# EAGLE schematic PSAS_Safety_System (EAGLE 6.2)
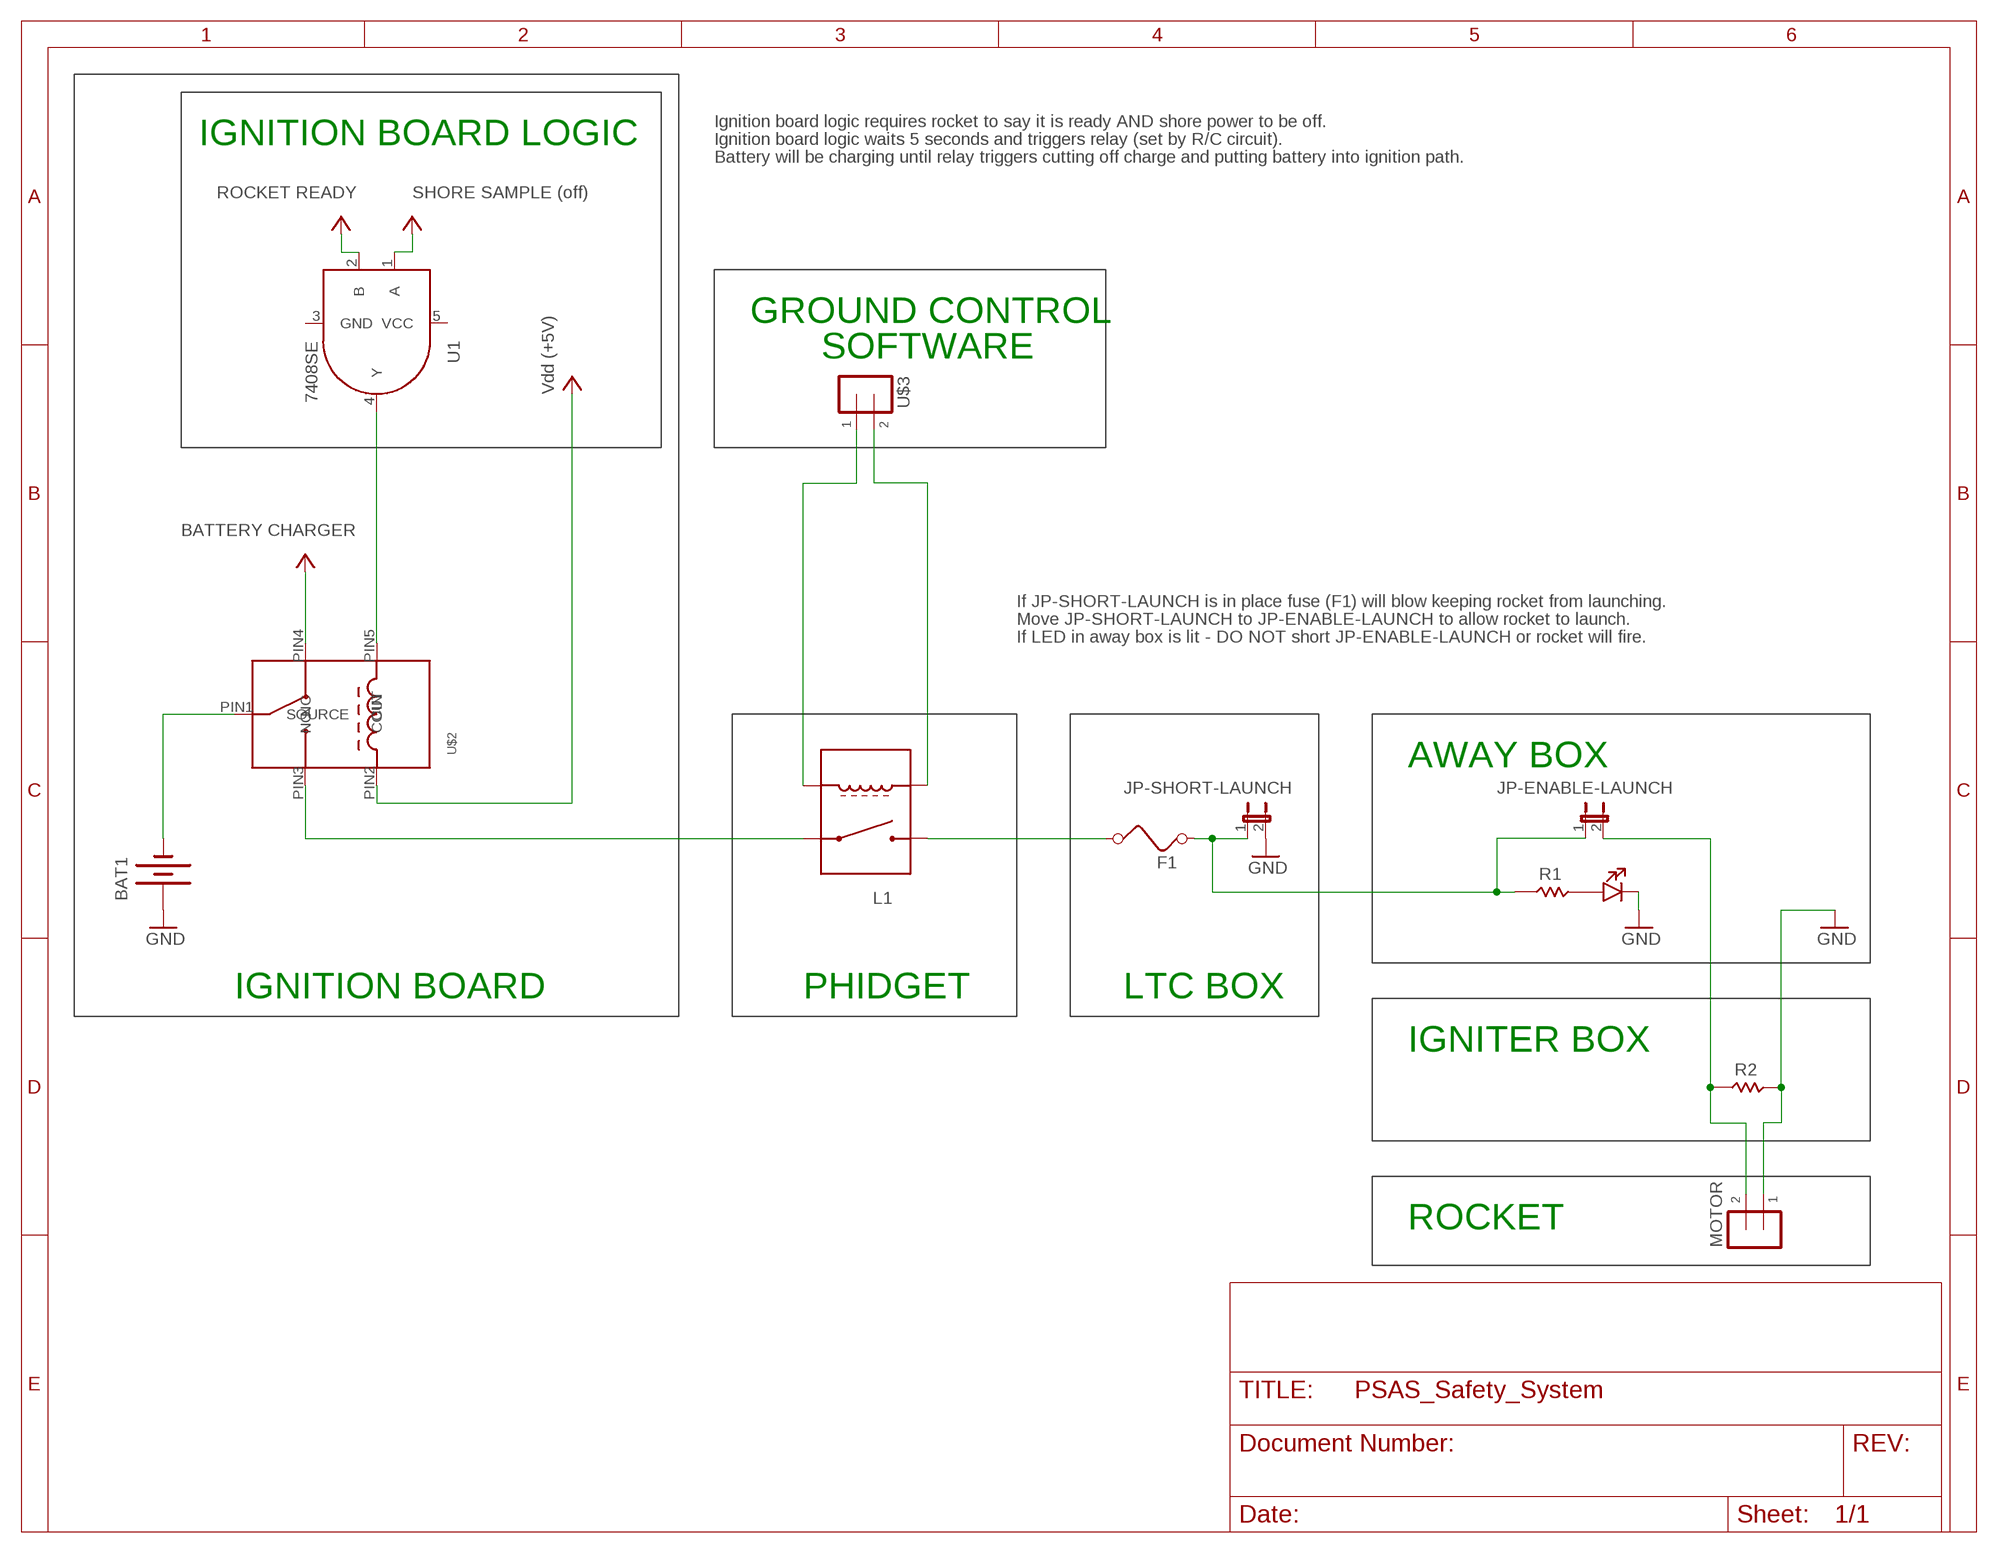
[diagram p0: schematic, sheet 1]

## Parts
BAT1  BATTERY12MM  [BATTCON_12MM]
F1  FUSE  [FUSE]
JP-ENABLE-LAUNCH  JP1E  [JP1]
JP-SHORT-LAUNCH  JP1E  [JP1]
L1  RELAY  [G5T-1A]
MOTOR  SCREW-TERMINAL-5MM  [SCREW-TERM-5MM]
R1  RESISTOR-0805  [0805]
R2  RESISTOR-0805  [0805]
U1  7408SE  [SOT353]
U$1  LED-550-XX04  [LED-550]
U$2  RELAY-2  [G5LA]
U$3  SCREW-TERMINAL-5MM  [SCREW-TERM-5MM]

## Nets
GND: BAT1.PWR@1(+) JP-SHORT-LAUNCH.2 MOTOR.1 R2.CATHODE U$1.CATHODE
N$1: R1.CATHODE U$1.ANODE
N$3: JP-ENABLE-LAUNCH.2 MOTOR.2 R2.ANODE
N$4: U1.4(Y) U$2.PIN5(CIN)
N$5: BAT1.GND(-) U$2.PIN1(SOURCE)
N$6: L1.SW1 U$2.PIN3(NO)
N$7: L1.CIN U$3.1
N$8: L1.COUT U$3.2
N$9: F1.2 L1.SW2
N$10: F1.1 JP-ENABLE-LAUNCH.1 JP-SHORT-LAUNCH.1 R1.ANODE
VCC: U1.1(A) U1.2(B) U$2.PIN2(COUT) U$2.PIN4(NC) ; supply symbol labelled BATTERY CHARGER, ROCKET READY, SHORE SAMPLE (off), Vdd (+5V)
Unconnected: U1.3(GND) U1.5(VCC)

## Notes on the sheet
- Ignition board logic requires rocket to say it is ready AND shore power to be off.
- IGNITION BOARD LOGIC | Ignition board logic waits 5 seconds and triggers relay (set by R/C circuit).
- Battery will be charging until relay triggers cutting off charge and putting battery into ignition path.
- GROUND CONTROL
- SOFTWARE
- If JP-SHORT-LAUNCH is in place fuse (F1) will blow keeping rocket from launching.
- Move JP-SHORT-LAUNCH to JP-ENABLE-LAUNCH to allow rocket to launch.
- If LED in away box is lit - DO NOT short JP-ENABLE-LAUNCH or rocket will fire.
- AWAY BOX
- IGNITION BOARD | PHIDGET | LTC BOX
- IGNITER BOX
- ROCKET

## Library data of the parts
BAT1 = SparkFun:BATTERY: Battery Holders Various common sizes : AA, AAA, 20mm coin cell and 12mm coin cell.
F1 = special:FUSE: FUSE 5 x 20 mm
JP-ENABLE-LAUNCH JP-SHORT-LAUNCH = jumper:JP1E: JUMPER
L1 = launch-tower:RELAY: FILTER pre-adjusted RF filter, type K, standard value E-12
MOTOR U$3 = launch-tower:SCREW-TERMINAL-5MM
R1 R2 = launch-tower:RESISTOR-0805
U1 = SparkFun-DigitalIC:74*08: Single 2-input AND gate
U$1 = launch-tower:LED-550-XX04
U$2 = launch-tower:RELAY-2